# Altium schematic sheet Outputs.SchDoc
size B; SheetNumber: 9; SheetTotal: 9
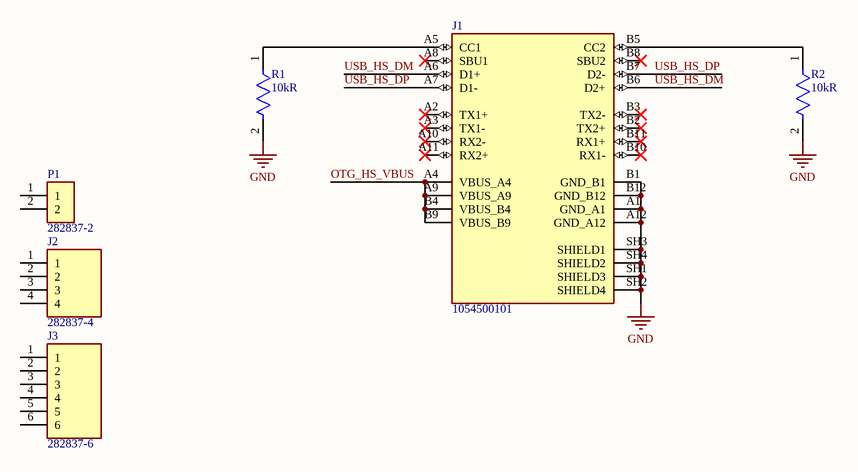
[diagram p0: Outputs.SchDoc]

## Parts
J1  1054500101  [MOLEX_1054500101]
J2  282837-4  [TE_282837-4]
J3  282837-6  [TE_282837-6]
P1  282837-2  [TE_282837-2]
R1  value 10kR  [FP-CPF0603-MFG]  (hidden comment: CPF0603B2K15E1)
R2  value 10kR  [FP-CPF0603-MFG]  (hidden comment: CPF0603B2K15E1)

## Nets
GND: J1.A1(GND_A1) J1.A12(GND_A12) J1.B1(GND_B1) J1.B12(GND_B12) J1.SH1(SHIELD3) J1.SH2(SHIELD4) J1.SH3(SHIELD1) J1.SH4(SHIELD2) R1.2 R2.2
OTG_HS_VBUS: J1.A4(VBUS_A4) J1.A9(VBUS_A9) J1.B4(VBUS_B4) J1.B9(VBUS_B9)
USB_HS_DM: J1.A6(D1+) J1.B6(D2+)
USB_HS_DP: J1.A7(D1-) J1.B7(D2-)
NetJ1_A5: J1.A5(CC1) R1.1
NetJ1_B5: J1.B5(CC2) R2.1

Not connected (* = marked no-connect by the designer): J1 A2(TX1+)* A3(TX1-)* A8(SBU1)* A10(RX2-)* A11(RX2+)* B2(TX2+)* B3(TX2-)* B8(SBU2)* B10(RX1-)* B11(RX1+)*; J2 1 2 3 4; J3 1 2 3 4 5 6; P1 1 2

## Library data of the parts
J1 = CMP-002-00073-1: USB-C (USB TYPE-C) USB 3.2 Gen 2 (USB 3.1 Gen 2, Superspeed + (USB 3.1)) Receptacle Connector 24 Position Surface Mount, Right Angle; Through Hole; MF: Molex; Source: 1054500101.SchLib; Design Item ID: 1054500101; Pins: 28; SnapEDA_Link: https://www.snapeda.com/parts/1054500101/Molex/view-part/?ref=snap; Value: *; Check_prices: https://www.snapeda.com/parts/1054500101/Molex/view-part/?ref=eda; Component Type: Standard; MP: 1054500101; Case/Package: None
J2 = CMP-057-000000-2: 4 Position Wire to Board Terminal Block Horizontal with Board 0.200 (5.08mm) Through Hole; MF: TE Connectivity; Availability: In Stock; Value: *; Purchase-URL: https://pricing.snapeda.com/search/part/282837-4/?ref=eda; Component Type: Standard; Source: 282837-4.SchLib; SnapEDA_Link: https://www.snapeda.com/parts/282837-4/TE+Connectivity+AMP+Connectors/view-part/?ref=snap; Price: None; Check_prices: https://www.snapeda.com/parts/282837-4/TE+Connectivity+AMP+Connectors/view-part/?ref=eda; Package: None; Design Item ID: 282837-4; EU_RoHS_Compliance: Compliant with Exemptions; Pin Count: 4; MP: 282837-4
J3 = CMP-002-00072-1: Conn Terminal Block F 6 POS 5.08mm Solder ST Thru-Hole 13.5A/Contact; MF: TE Connectivity; Price: None; Pins: 6; EU_RoHS_Compliance: Compliant with Exemptions; MP: 282837-6; Availability: Unavailable; Source: SnapEDAsch.SchLib; Component Type: Standard; Design Item ID: 282837-6; TE_purchase_URL: https://www.te.com/usa-en/product-282837-6.html?te_bu=Cor&te_type=disp&te_campaign=seda_glo_cor-seda-global-disp-prtnr-fy19-seda-model-bom-cta_sma-317_1&elqCampaignId=32493; Value: *; Case/Package: None; SnapEDA_Link: https://www.snapeda.com/parts/282837-6/TE%20Connectivity%20AMP%20Connectors/view-part/520355/?ref=snap
P1 = CMP-055-000000-1: Ð Ð°Ð·ÑŠÐµÐ¼Ð½Ñ‹Ðµ ÐºÐ»ÐµÐ¼Ð¼Ð½Ñ‹Ðµ ÐºÐ¾Ð»Ð¾Ð´ÐºÐ¸ Ð Ð¾Ð·ÐµÑ‚ÐºÐ° 2 Ð¿Ð¾Ð»Ð¾Ð¶ÐµÐ½Ð¸Ñ 5,08 Ð¼Ð¼ ÐŸÑ€Ð¸Ð¿Ð¾Ð¹ Ð¿Ñ€ÑÐ¼Ð¾Ð¹ Ñ‡ÐµÑ€ÐµÐ· Ð¾Ñ‚Ð²ÐµÑ€ÑÑ‚Ð¸Ðµ 13,5 Ð / ÐºÐ¾Ð½Ñ‚Ð°ÐºÑ‚; MF: TE Connectivity; Price: None; Design Item ID: 282837-2; Component Type: Standard; Source: 282837-2.SchLib; Check_prices: https://www.snapeda.com/parts/282837-2/TE+Connectivity+AMP+Connectors/view-part/?ref=eda; Purchase-URL: https://pricing.snapeda.com/search/part/282837-2/?ref=eda; Pin Count: 2; MP: 282837-2; Package: None; Availability: In Stock; SnapEDA_Link: https://www.snapeda.com/parts/282837-2/TE+Connectivity+AMP+Connectors/view-part/?ref=snap; Value: *
R1 R2 = CMP-03211-008657-1: RES SMD 2.15KΩ 0.1% 1/16W 0603; Manufacturer: TE Connectivity; Temperature Coefficient: 25ppm/°C; Voltage Rating: 50V; Power Rating: 0.063W; Height: 0.55mm; Series: CPF; ComponentLink2Description: Datasheet; Package: CPF0603; Automotive: No; octopart_url: https://octopart.com/cpf0603b2k15e1-te+connectivity-22739551; Lead Free: Yes; Temperature: -55°C to +155°C; RoHS: TRUE; Ipc Land Pattern Name: RESC15580X45; Temperature Range Low: -55°C; Composition: Thin Film; Device Class L3: Chip SMD Resistors; Category: Res; Octopart: https://octopart.com/cpf0603b2k15e1-te+connectivity-22739551; Resistance: 2.15KΩ; ComponentLink2URL: https://www.te.com/commerce/DocumentDelivery/DDEController?Action=showdoc&DocId=Data+Sheet%7F1773200%7FM%7Fpdf%7FEnglish%7FENG_DS_1773200_M.pdf%7F3-1676481-2; Manufacturer Part Number: CPF0603B2K15E1; packaging: 1k Reel; Tolerance: 0.1%; Temperature Range High: +155°C; Device Class L1: Passive Components; Device Class L2: Resistors